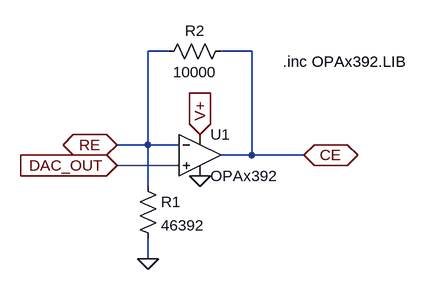
[diagram p0: schematic OPA2392_Control_Amp.asc]
OPA2392_Control_Amp.asc, the LTspice schematic file:
Version 4
SHEET 1 880 680
WIRE 240 -176 208 -176
WIRE 368 -176 320 -176
WIRE 208 -32 208 -176
WIRE 208 -32 160 -32
WIRE 256 -32 208 -32
WIRE 368 -16 368 -176
WIRE 368 -16 320 -16
WIRE 448 -16 368 -16
WIRE 256 0 160 0
WIRE 208 32 208 -32
WIRE 208 144 208 112
FLAG 288 -48 V+
IOPIN 288 -48 In
FLAG 288 16 0
FLAG 160 0 DAC_OUT
IOPIN 160 0 In
FLAG 160 -32 RE
IOPIN 160 -32 BiDir
FLAG 208 144 0
FLAG 448 -16 CE
IOPIN 448 -16 BiDir
SYMBOL OpAmps\\opamp2 288 -80 R0
SYMATTR InstName U1
SYMATTR Value OPAx392
SYMBOL res 192 16 R0
SYMATTR InstName R1
SYMATTR Value 46392
SYMBOL res 336 -192 R90
WINDOW 0 0 56 VBottom 2
WINDOW 3 32 56 VTop 2
SYMATTR InstName R2
SYMATTR Value 10000
TEXT 416 -160 Left 2 !.inc OPAx392.LIB

The netlist it stands for:
* OPA2392_Control_Amp.asc
XU1 DAC_OUT RE V+ 0 CE OPAx392  ; pins In+ In- V+ V- OUT
R1 RE 0 46392
R2 CE RE 10000
.inc OPAx392.LIB
.backanno
.end